# EAGLE design Philophrosyne (EAGLE 9.6.2)
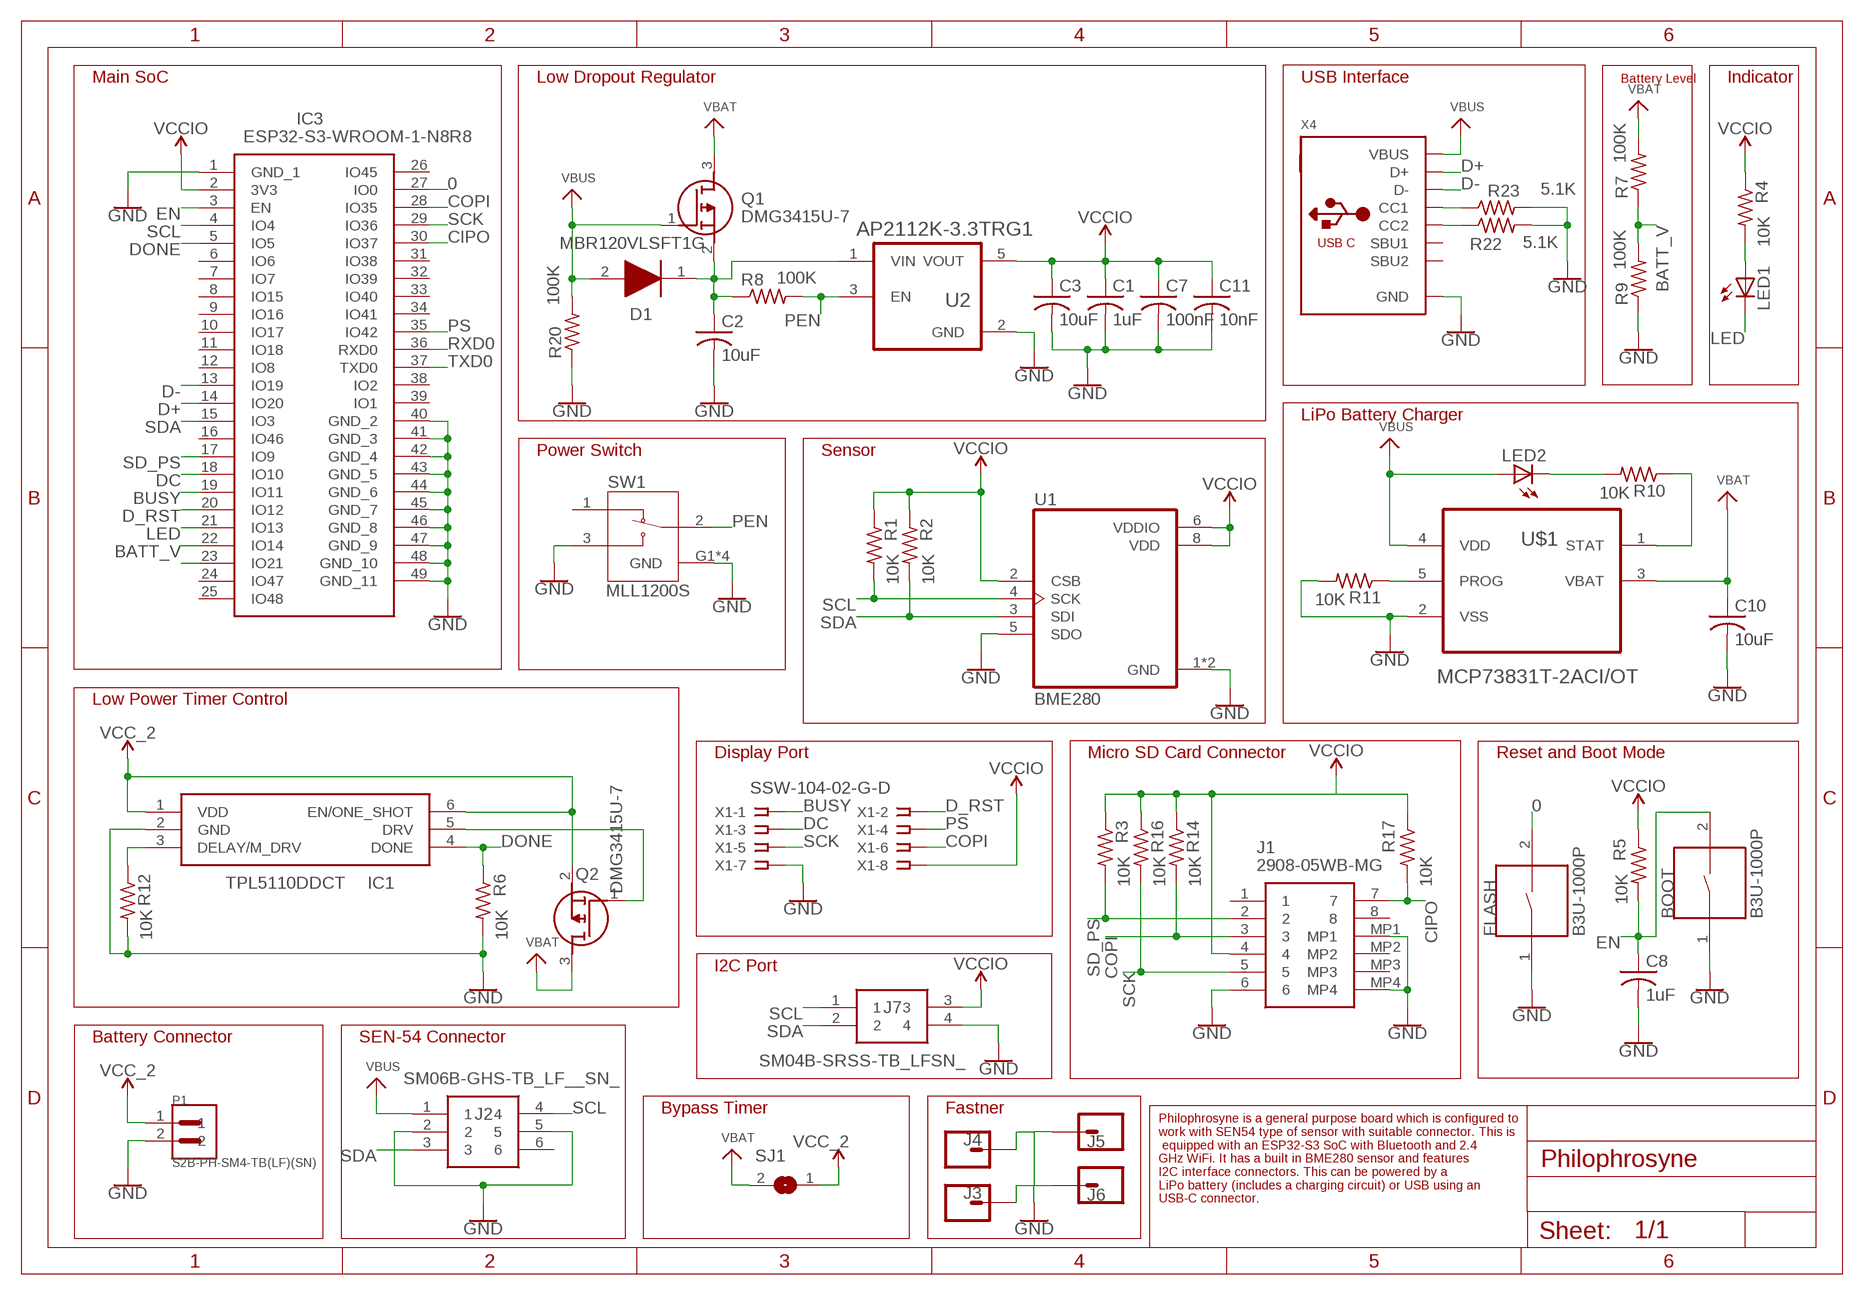
[diagram p0: schematic, sheet 1]

## Parts
BOOT  B3U-1000P  [SW_B3U-1000P]
C1  1uF  C-USC0402  [C0402]
C2  10uF  C-USC0402  [C0402]
C3  10uF  C-USC0402  [C0402]
C7  100nF  C-USC0402  [C0402]
C8  1uF  C-USC0402  [C0402]
C10  10uF  C-USC0402  [C0402]
C11  10nF  C-USC0402  [C0402]
D1  MBR120VLSFT1G  [SODFL3616X98N]
FLASH  B3U-1000P  [SW_B3U-1000P]
IC1  TPL5110DDCT  [SOT95P280X110-6N]
IC3  ESP32-S3-WROOM-1-N8R8  [ESP32S3WROOM1N8R8]
J1  2908-05WB-MG  [290805WBMG]
J2  SM06B-GHS-TB_LF__SN_  [SM06B-GHS-TB]
J3  CONN_01PTH_2MM  [1X01_2MM]
J4  CONN_01PTH_2MM  [1X01_2MM]
J5  CONN_01PTH_2MM  [1X01_2MM]
J6  CONN_01PTH_2MM  [1X01_2MM]
J7  SM04B-SRSS-TB_LFSN_  [SM04B-SRSS-TB(LFSN)]
LED1  LEDCHIP-LED0603  [CHIP-LED0603]
LED2  LEDCHIP-LED0603  [CHIP-LED0603]
P1  S2B-PH-SM4-TB(LF)(SN)  [JST_S2B-PH-SM4-TB(LF)(SN)]
Q1  DMG3415U-7  [SOT96P240X100-3N]
Q2  DMG3415U-7  [SOT96P240X100-3N]
R1  10K  R-US_R0402  [R0402]
R2  10K  R-US_R0402  [R0402]
R3  10K  R-US_R0402  [R0402]
R4  10K  R-US_R0402  [R0402]
R5  10K  R-US_R0402  [R0402]
R6  10K  R-US_R0402  [R0402]
R7  100K  R-US_R0402  [R0402]
R8  100K  R-US_R0402  [R0402]
R9  100K  R-US_R0402  [R0402]
R10  10K  R-US_R0402  [R0402]
R11  10K  R-US_R0402  [R0402]
R12  10K  R-US_R0402  [R0402]
R14  10K  R-US_R0402  [R0402]
R16  10K  R-US_R0402  [R0402]
R17  10K  R-US_R0402  [R0402]
R20  100K  R-US_R0402  [R0402]
R22  5.1K  R-US_R0402  [R0402]
R23  5.1K  R-US_R0402  [R0402]
SJ1  SJ  [SJ]
SW1  MLL1200S  [SW_MLL1200S]
U1  BME280  [PSON65P250X250X100-8N]
U2  AP2112K-3.3TRG1  [SOT95P285X140-5N]
U$1  MCP73831T-2ACI/OT  [SOT95P280X145-5N]
X1  SSW-104-02-G-D  [SSW-104-02-G-D]
X4  MICROBUILDER_USB_C  [MICROBUILDER_USB_C_CUSB31-CFM2AX-01-X]

## Nets
0: FLASH.2 IC3.27(IO0)
BATT_V: IC3.22(IO14) R7.1 R9.2
BUSY: IC3.19(IO11) X1.1
CIPO: IC3.30(IO37) J1.7 R17.2
COPI: IC3.28(IO35) J1.3 R14.2 X1.6
D+: IC3.14(IO20) X4.A6(D+) X4.B6(D+)
D-: IC3.13(IO19) X4.A7(D-) X4.B7(D-)
D_RST: IC3.20(IO12) X1.2
DC: IC3.18(IO10) X1.3
DONE: IC1.4(DONE) IC3.5(IO5) R6.1
EN: BOOT.2 C8.1 IC3.3(EN) R5.2
GND: BOOT.1 C1.2 C2.2 C3.2 C7.2 C8.2 C10.2 C11.2 FLASH.1 IC1.2(GND) IC3.1(GND_1) IC3.40(GND_2) IC3.41(GND_3) IC3.42(GND_4) IC3.43(GND_5) IC3.44(GND_6) IC3.45(GND_7) IC3.46(GND_8) IC3.47(GND_9) IC3.48(GND_10) IC3.49(GND_11) J1.6 J1.MP1 J1.MP4 J2.2 J2.5 J3.1 J4.1 J5.1 J6.1 J7.4 P1.2 R6.2 R9.1 R11.2 R12.2 R20.1 R22.2 R23.2 SW1.3 SW1.G1(GND) SW1.G2(GND) SW1.G3(GND) SW1.G4(GND) U1.1(GND) U1.5(SDO) U1.7(GND) U2.2(GND) U$1.2(VSS) X1.7 X4.A1B12(GND) X4.B1A12(GND)
LED: IC3.21(IO13) LED1.C
N$5: C2.1 D1.1(K) Q1.2(S) R8.1 U2.1(VIN)
N$6: IC3.23(IO21)
N$7: R22.1 X4.B5(CC2)
N$8: R11.1 U$1.5(PROG)
N$9: R23.1 X4.A5(CC1)
N$10: LED1.A R4.2
N$12: IC1.5(DRV) Q2.1(G)
N$14: R10.1 U$1.1(STAT)
N$16: LED2.C R10.2
N$17: IC1.3(DELAY/M_DRV) R12.1
PEN: R8.2 SW1.2 U2.3(EN)
PS: IC3.35(IO42) X1.4
RXD0: IC3.36(RXD0)
SCK: IC3.29(IO36) J1.5 R16.2 X1.5
SCL: IC3.4(IO4) J2.4 J7.1 R1.2 U1.4(SCK)
SD_PS: IC3.17(IO9) J1.2 R3.2
SDA: IC3.15(IO3) J2.3 J7.2 R2.2 U1.3(SDI)
TXD0: IC3.37(TXD0)
VBAT: C10.1 Q1.3(D) Q2.3(D) R7.2 SJ1.2 U$1.3(VBAT)
VBUS: D1.2(A) J2.1 LED2.A Q1.1(G) R20.2 U$1.4(VDD) X4.A4B9(VBUS) X4.B4A9(VBUS)
VCC_2: IC1.1(VDD) IC1.6(EN/ONE_SHOT) P1.1 Q2.2(S) SJ1.1
VCCIO: C1.1 C3.1 C7.1 C11.1 IC3.2(3V3) J1.4 J7.3 R1.1 R2.1 R3.1 R4.1 R5.1 R14.1 R16.1 R17.1 U1.2(CSB) U1.6(VDDIO) U1.8(VDD) U2.5(VOUT) X1.8
Unconnected: IC3.6(IO6) IC3.7(IO7) IC3.8(IO15) IC3.9(IO16) IC3.10(IO17) IC3.11(IO18) IC3.12(IO8) IC3.16(IO46) IC3.24(IO47) IC3.25(IO48) IC3.26(IO45) IC3.31(IO38) IC3.32(IO39) IC3.33(IO40) IC3.34(IO41) IC3.38(IO2) IC3.39(IO1) J1.1 J1.8 J1.MP2 J1.MP3 J2.6 SW1.1 X4.A8(SBU1) X4.B8(SBU2)

## Notes on the sheet
- Main SoC | Low Dropout Regulator | USB Interface | Battery Level | Indicator
- LiPo Battery Charger
- Power Switch | Sensor
- Low Power Timer Control
- Display Port | Micro SD Card Connector | Reset and Boot Mode
- I2C Port
- Battery Connector | SEN-54 Connector
- Bypass Timer | Fastner
- Philophrosyne is a general purpose board which is configured to 
  work with SEN54 type of sensor with suitable connector. This is
   equipped with an ESP32-S3 SoC with Bluetooth and 2.4 
  GHz WiFi. It has a built in BME280 sensor and features 
  I2C interface connectors. This can be powered by a 
  LiPo battery (includes a charging circuit) or USB using an 
  USB-C connector.

## Library data of the parts
BOOT FLASH = B3U-1000P:B3U-1000P: Switch Tactile N.O. SPST Round Button Gull Wing 0.05A 12VDC 1.5N SMD Embossed T/R; AVAILABILITY: Unavailable; DESCRIPTION: Switch Tactile N.O. SPST Round Button Gull Wing 0.05A 12VDC 1.5N SMD Embossed T/R; MF: Omron; MP: B3U-1000P; PACKAGE: None; PRICE: None
C1-C3 C7 C8 C10 C11 = adafruit:C-US: CAPACITOR, American symbol
D1 = MBR120VLSFT1G:MBR120VLSFT1G: Diode Schottky 20V 1A SOD123FL ON Semi MBR120VLSFT1G, SMT Schottky Diode, 20V 1A, 2-Pin SOD-123FL Source: Datasheet <http://www.onsemi.com/pub/Collateral/MBR120VLSFT1-D.PDF>; DESCRIPTION: Diode Schottky 20V 1A SOD123FL ON Semi MBR120VLSFT1G, SMT Schottky Diode, 20V 1A, 2-Pin SOD-123FL; HEIGHT: 0.98mm; MANUFACTURER_NAME: ON Semiconductor; MANUFACTURER_PART_NUMBER: MBR120VLSFT1G; MOUSER_PART_NUMBER: 863-MBR120VLSFT1G; MOUSER_PRICE-STOCK: https://www.mouser.co.uk/ProductDetail/ON-Semiconductor/MBR120VLSFT1G?qs=3JMERSakebpX%252BkItPpFCkg%3D%3D
IC1 = TPL5110DDCT:TPL5110DDCT: Ultra Low Power Timer with MOS driver and MOSFET Power ON Source: Datasheet <https://datasheet.datasheetarchive.com/originals/distributors/DKDS-23/444465.pdf>; ARROW_PART_NUMBER: TPL5110DDCT; ARROW_PRICE-STOCK: https://www.arrow.com/en/products/tpl5110ddct/texas-instruments?utm_currency=USD&region=nac; DESCRIPTION: Ultra Low Power Timer with MOS driver and MOSFET Power ON; HEIGHT: 1.1mm; MANUFACTURER_NAME: Texas Instruments; MANUFACTURER_PART_NUMBER: TPL5110DDCT; MOUSER_PART_NUMBER: 595-TPL5110DDCT; MOUSER_PRICE-STOCK: https://www.mouser.co.uk/ProductDetail/Texas-Instruments/TPL5110DDCT?qs=beZBGHSk9c2OL5zXl%2FkTOg%3D%3D
IC3 = ESP32-S3-WROOM-1-N8R8:ESP32-S3-WROOM-1-N8R8: WiFi Modules - 802.11 (Engineering Samples Only) SMD Module, ESP32-S3R8 with 8 MB Octal PSRAM Die, 8 MB Quad SPI flash, PCB Antenna Source: Datasheet <https://www.espressif.com/sites/default/files/documentation/esp32-s3-wroom-1_wroom-1u_datasheet_en.pdf>; DESCRIPTION: WiFi Modules - 802.11 (Engineering Samples Only) SMD Module, ESP32-S3R8 with 8 MB Octal PSRAM Die, 8 MB Quad SPI flash, PCB Antenna; HEIGHT: 3.25mm; MANUFACTURER_NAME: Espressif Systems; MANUFACTURER_PART_NUMBER: ESP32-S3-WROOM-1-N8R8; MOUSER_PART_NUMBER: 356-EP32S3WROOM1N8R8; MOUSER_PRICE-STOCK: https://www.mouser.co.uk/ProductDetail/Espressif-Systems/ESP32-S3-WROOM-1-N8R8?qs=7D1LtPJG0i3%2F28hKFavOpQ%3D%3D
J1 = 2908-05WB-MG:2908-05WB-MG: Memory Card Connectors MICROSD 8P P/P SMT POLARIZED Source: Datasheet <https://componentsearchengine.com/Datasheets/1/2908-05WB-MG.pdf>; ARROW_PART_NUMBER: 2908-05WB-MG; ARROW_PRICE-STOCK: https://www.arrow.com/en/products/2908-05wb-mg/3m?region=europe; DESCRIPTION: Memory Card Connectors MICROSD 8P P/P SMT POLARIZED; HEIGHT: 1.85mm; MANUFACTURER_NAME: 3M; MANUFACTURER_PART_NUMBER: 2908-05WB-MG; MOUSER_PART_NUMBER: 517-2908-05WB-MG; MOUSER_PRICE-STOCK: https://www.mouser.co.uk/ProductDetail/3M-Electronic-Solutions-Division/2908-05WB-MG?qs=vnwGVgFuQiZPJoOt79ALlw%3D%3D
J2 = SM06B-GHS-TB_LF__SN_:SM06B-GHS-TB_LF__SN_: GH 1.25mm header side entry 6 way JST GH Series, 1.25mm Pitch 6 Way Right Angle PCB Header, Solder Termination, 1A Source: Datasheet <https://datasheet.datasheetarchive.com/originals/distributors/Datasheets_SAMA/e4ef010dc292ea31091454f6c0afb63a.pdf>; ARROW_PART_NUMBER: SM06B-GHS-TB(LF)(SN); ARROW_PRICE-STOCK: https://www.arrow.com/en/products/sm06b-ghs-tb-lf-sn/jst-manufacturing; DESCRIPTION: GH 1.25mm header side entry 6 way JST GH Series, 1.25mm Pitch 6 Way Right Angle PCB Header, Solder Termination, 1A; HEIGHT: mm; MANUFACTURER_NAME: JST (JAPAN SOLDERLESS TERMINALS); MANUFACTURER_PART_NUMBER: SM06B-GHS-TB(LF)(SN); MOUSER_PART_NUMBER: N/A; MOUSER_PRICE-STOCK: https://www.mouser.co.uk/ProductDetail/JST-Commercial/SM06B-GHS-TBLFSN?qs=QpmGXVUTftFzTQe43vH9Ig%3D%3D
J3-J6 = SparkFun-Connectors:CONN_01: Single connection point. Often used as Generic Header-pin footprint for 0.1 inch spaced/style header connections On any of the 0.1 inch spaced packages, you can populate with these: Break Away Headers - Straight <https://www.sparkfun.com/products/116> (PRT-00116) Break Away Male Headers - Right Angle <https://www.sparkfun.com/products/553> (PRT-00553) Female Headers <https://www.sparkfun.com/products/115> (PRT-00115) Break Away Headers - Machine Pin <https://www.sparkfun.com/products/117> (PRT-00117) Break Away Female Headers - Swiss Machine Pin <https://www.sparkfun.com/products/743> (PRT-00743) This device is also useful as a general connection point to wire up your design to another part of your project. Our various solder wires solder well into these plated through hole pads. Hook-Up Wire - Assortment (Stranded, 22 AWG) <https://www.sparkfun.com/products/11375> (PRT-11375) Hook-Up Wire - Assortment (Solid Core, 22 AWG) <https://www.sparkfun.com/products/11367> (PRT-11367) View the entire wire category on our website here <https://www.sparkfun.com/categories/141> Special notes: SMTSO-256-ET is a "flush mount" nut for a 4-40 screw. We mostly use this on specialty testbeds; it is a nice way to connect hardware to your PCB at an adjustable hieght. Also note, the SNAP packages are for using a snappable style connector. We sell a baggie of snaps and they are also used on two LilyPad designs: Snap Assortment - 30 pack (male and female) <https://www.sparkfun.com/products/11347> (DEV-11347) LilyPad Arduino SimpleSnap <https://www.sparkfun.com/products/10941> (DEV-10941) LilyPad SimpleSnap Protoboard <https://www.sparkfun.com/products/10940> (DEV-10940)
J7 = SM04B-SRSS-TB_LFSN_:SM04B-SRSS-TB_LFSN_: 4 way side entry SMT header,1mm pitch JST SH Series, 1mm Pitch 4 Way 1 Row Right Angle PCB Header, Solder Termination, 1A Source: Datasheet; DESCRIPTION: 4 way side entry SMT header,1mm pitch JST SH Series, 1mm Pitch 4 Way 1 Row Right Angle PCB Header, Solder Termination, 1A; HEIGHT: mm; MANUFACTURER_NAME: JST (JAPAN SOLDERLESS TERMINALS); MANUFACTURER_PART_NUMBER: SM04B-SRSS-TB(LFSN)
LED1 LED2 = adafruit_Tanmoy:LED: LED OSRAM: - CHIPLED LG R971, LG N971, LY N971, LG Q971, LY Q971, LO R971, LY R971 LH N974, LH R974 LS Q976, LO Q976, LY Q976 LO Q996 - Hyper CHIPLED LW Q18S LB Q993, LB Q99A, LB R99A - SideLED LS A670, LO A670, LY A670, LG A670, LP A670 LB A673, LV A673, LT A673, LW A673 LH A674 LY A675 LS A676, LA A676, LO A676, LY A676, LW A676 LS A679, LY A679, LG A679 - Hyper Micro SIDELED® LS Y876, LA Y876, LO Y876, LY Y876 LT Y87S - SmartLED LW L88C, LW L88S LB L89C, LB L89S, LG L890 LS L89K, LO L89K, LY L89K LS L896, LA L896, LO L896, LY L896 - TOPLED LS T670, LO T670, LY T670, LG T670, LP T670 LSG T670, LSP T670, LSY T670, LOP T670, LYG T670 LG T671, LOG T671, LSG T671 LB T673, LV T673, LT T673, LW T673 LH T674 LS T676, LA T676, LO T676, LY T676, LB T676, LH T676, LSB T676, LW T676 LB T67C, LV T67C, LT T67C, LS T67K, LO T67K, LY T67K, LW E67C LS E67B, LA E67B, LO E67B, LY E67B, LB E67C, LV E67C, LT E67C LW T67C LS T679, LY T679, LG T679 LS T770, LO T770, LY T770, LG T770, LP T770 LB T773, LV T773, LT T773, LW T773 LH T774 LS E675, LA E675, LY E675, LS T675 LS T776, LA T776, LO T776, LY T776, LB T776 LHGB T686 LT T68C, LB T68C - Hyper Mini TOPLED® LB M676 - Mini TOPLED Santana® LG M470 LS M47K, LO M47K, LY M47K Source: http://www.osram.convergy.de/
P1 = S2B-PH-SM4-TB_LF__SN_:S2B-PH-SM4-TB(LF)(SN): CONN HEADER PH SIDE 2POS 2MM SMD; AVAILABILITY: Unavailable; DESCRIPTION: Connector Header Surface Mount, Right Angle 2 position 0.079 _2.00mm_; MF: JST Sales; MP: S2B-PH-SM4-TB _LF__SN_; PACKAGE: None; PRICE: None
Q1 Q2 = DMG3415U-7:DMG3415U-7: P-CHANNEL ENHANCEMENT MODE MOSFET Source: Datasheet <https://datasheet.lcsc.com/szlcsc/Diodes-Incorporated-DMG3415U-7_C96616.pdf>; DESCRIPTION: P-CHANNEL ENHANCEMENT MODE MOSFET; HEIGHT: 1mm; LCSC_PART_NUMBER: C96616; LCSC_PRICE-STOCK: https://lcsc.com/product-detail/MOSFET_Diodes-Incorporated_DMG3415U-7_Diodes-Incorporated-DMG3415U-7_C96616.html; MANUFACTURER_NAME: Diodes Inc.; MANUFACTURER_PART_NUMBER: DMG3415U-7
R1-R12 R14 R16 R17 R20 R22 R23 = adafruit:R-US_: RESISTOR, American symbol
SJ1 = jumper:SJ: SMD solder JUMPER
SW1 = MLL1200S:MLL1200S: Switch Slide SPDT Side Slide 0.3A 4VDC Gull Wing SMD Box Check prices <https://pricing.snapeda.com/parts/MLL1200S/TE%20Connectivity/view-part?ref=eda>; AVAILABILITY: In Stock; COMMENT: 1437575-1; DESCRIPTION: Slide Switch SPDT Surface Mount, Right Angle; MF: TE Connectivity; MP: MLL1200S; PACKAGE: None; PRICE: None; PURCHASE-URL: https://pricing.snapeda.com/search/part/MLL1200S/?ref=eda
U1 = BME280:BME280: Check availability <https://pricing.snapeda.com/parts/BME280/Bosch/view-part?ref=eda>; AVAILABILITY: In Stock; CHECK_PRICES: https://www.snapeda.com/parts/BME280/Bosch/view-part/?ref=eda; DESCRIPTION: Board Mount Humidity Sensors MEMS humidity, pressure and temperature sensor; MF: Bosch; MP: BME280; PACKAGE: LGA-8 Bosch; PRICE: None; SNAPEDA_LINK: https://www.snapeda.com/parts/BME280/Bosch/view-part/?ref=snap
U2 = AP2112K-3.3TRG1:AP2112K-3.3TRG1: AP2112 Series 0.6 A 3.3 V Fixed Output SMT LDO Linear Regulator - SOT23-5; AVAILABILITY: Unavailable; DESCRIPTION: AP2112 Series 0.6 A 3.3 V Fixed Output SMT LDO Linear Regulator - SOT23-5; MF: Diodes Inc.; MP: AP2112K-3.3TRG1; PACKAGE: SOT-753 Diodes Inc.; PRICE: None
U$1 = MCP73831T-2ACI_OT:MCP73831T-2ACI/OT: Charge Management Controller; AVAILABILITY: Unavailable; DESCRIPTION: MCP73831 Series Single-Cell Li-Ion/Li-Polymer Battery Charge Controller SOT-23-5; MF: Microchip; MP: MCP73831T-2ACI/OT; PACKAGE: SOT-23 Microchip; PRICE: None
X1 = con-samtec:SSW-104-02-G: THROUGH-HOLE .025" SQ POST SOCKET Source: Samtec SSW.pdf; MF: Samtec Inc.; MPN: SSW-104-02-G-D; OC_FARNELL: 1668346; OC_NEWARK: 11P9382
X4 = Adafruit Feather STM32F405 Express:MICROBUILDER_USB_C: USB Type-C USB 2.0 Connector

## Board
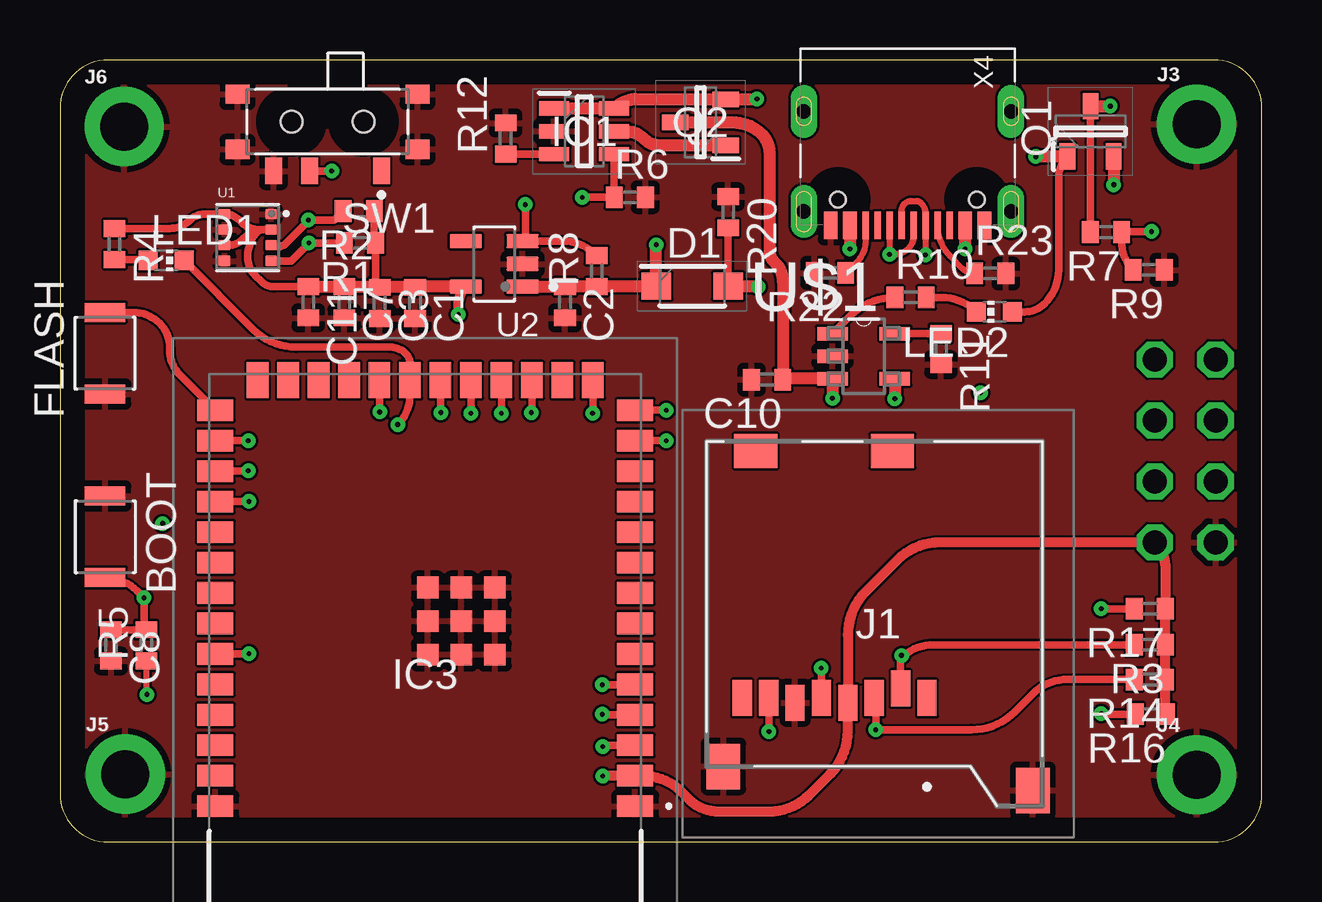
[diagram p1: board, top side]
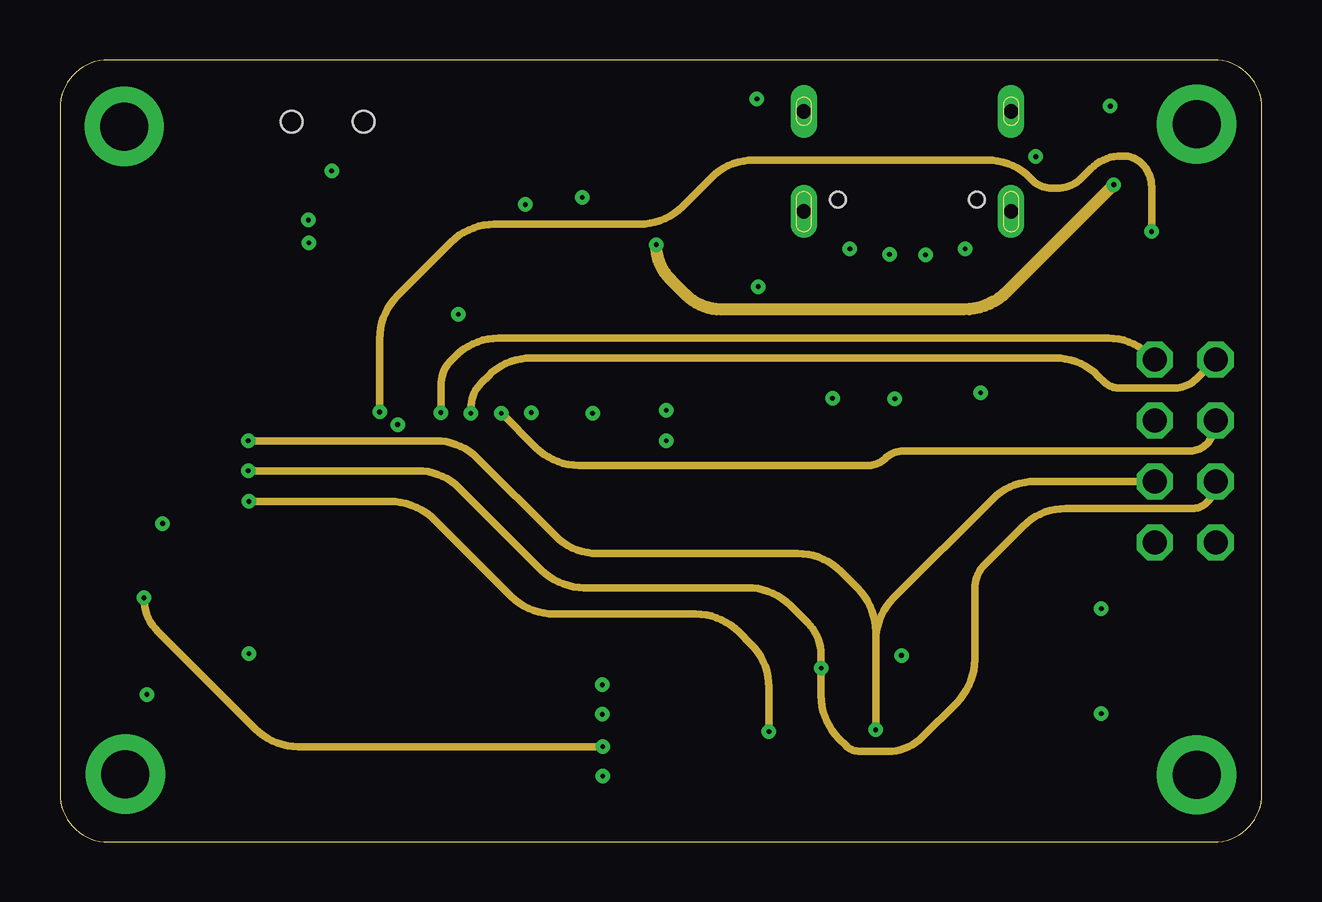
[diagram p2: board, inner layer Route2]
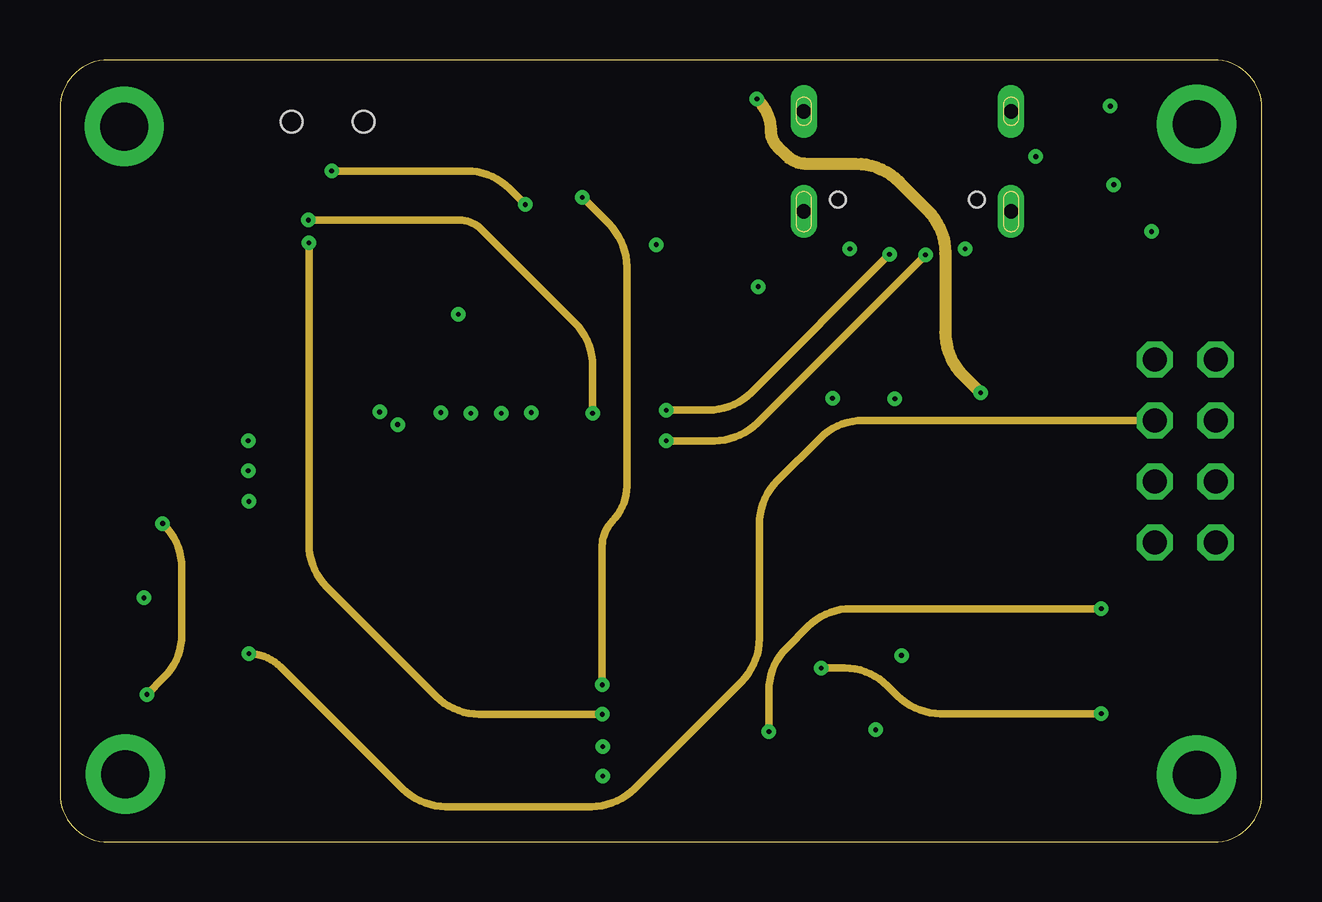
[diagram p3: board, inner layer Route15]
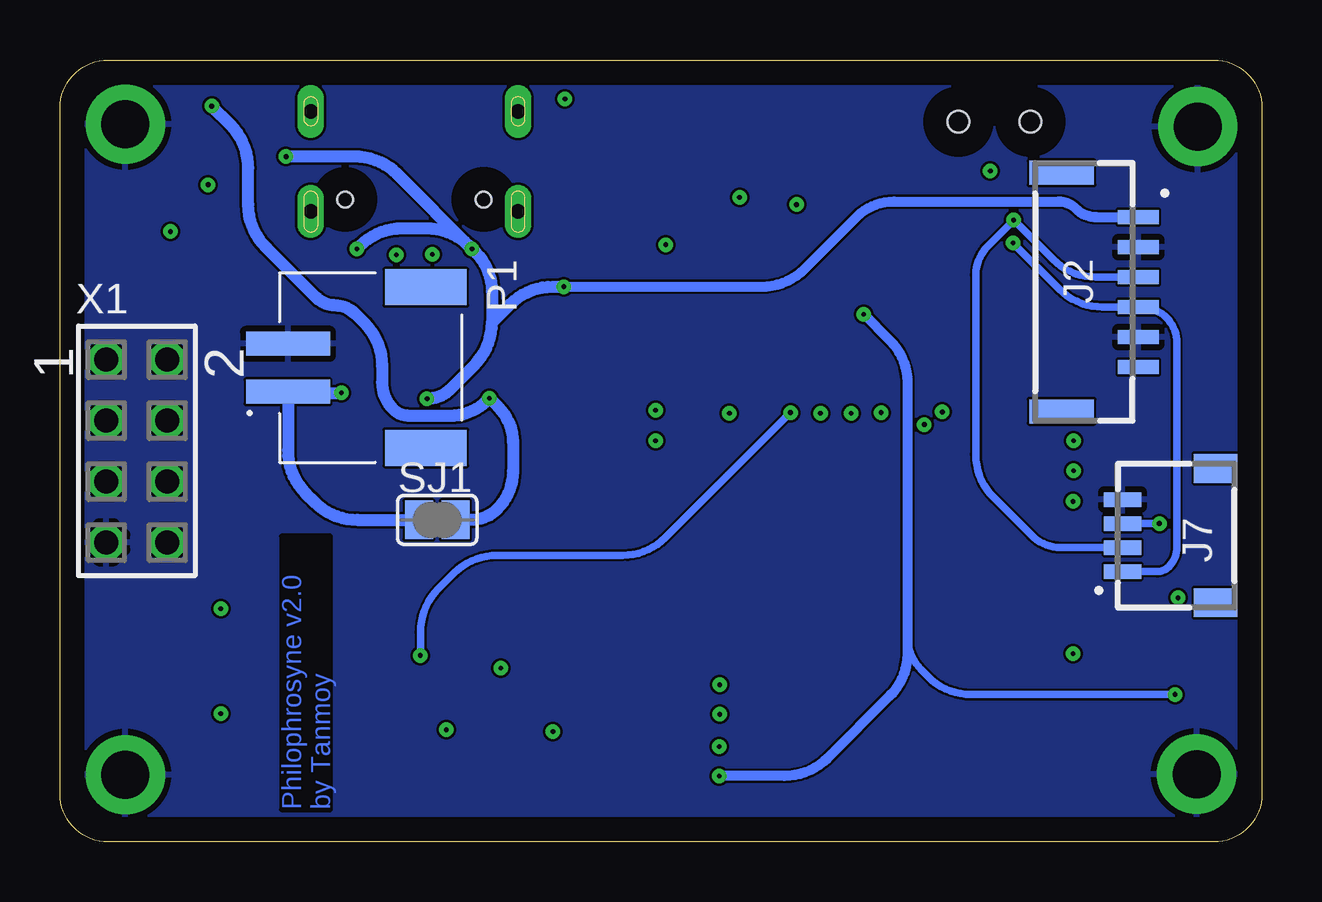
[diagram p4: board, bottom side, seen from below]

Size 50.1 x 32.6 mm. Coordinates in mm from the lower left corner, seen from the top.
Outline: 2,0 48.1,0 arc90 50.1,2 50.1,30.6 arc90 48.1,32.6 2,32.6 arc90 0,30.6 0,2 arc90 2,0
Copper layers (1+2+15+16): Top 0.035mm / dielectric 1.5mm / Route2 0.035mm / dielectric 0.15mm / Route15 0.035mm / dielectric 0.2mm / Bottom 0.035mm
Design rules "default *": minimum track width 4mil, minimum drill 0.2mm, track to track 4mil, track to pad 4mil, pad to pad 4mil, via to via 4mil, smd to smd 4mil, copper to edge 40mil, drill to drill 4mil, minimum pad ring 10mil, minimum via ring 8mil, stop-mask expansion 4mil, vias tented up to drill 0mil, thermal gap 10mil

### Footprints (pad centres in the part's own frame; a part is rotated, then mirrored left to right if it is on the bottom)
SW_B3U-1000P = smd 0.8 x 1.7: 1 -1.7,0; 2 1.7,0
C0402 = smd 0.7 x 0.9: 1 -0.65,0; 2 0.65,0
SODFL3616X98N = smd 1.24 x 1.12: 1 -1.5,0; 2 1.5,0
SOT95P280X110-6N = smd 1.25 x 0.6: 1 -1.25,0.95; 2 -1.25,0; 3 -1.25,-0.95; 4 1.25,-0.95; 5 1.25,0; 6 1.25,0.95
ESP32S3WROOM1N8R8 = smd 1.5 x 0.9: 1 -8.75,5.26; 2 -8.75,3.99; 3 -8.75,2.72; 4 -8.75,1.45; 5 -8.75,0.18; 6 -8.75,-1.09; 7 -8.75,-2.36; 8 -8.75,-3.63; 9 -8.75,-4.9; 10 -8.75,-6.17; 11 -8.75,-7.44; 12 -8.75,-8.71; 13 -8.75,-9.98; 14 -8.75,-11.25; 27 8.75,-11.25; 28 8.75,-9.98; 29 8.75,-8.71; 30 8.75,-7.44; 31 8.75,-6.17; 32 8.75,-4.9; 33 8.75,-3.63; 34 8.75,-2.36; 35 8.75,-1.09; 36 8.75,0.18; 37 8.75,1.45; 38 8.75,2.72; 39 8.75,3.99; 40 8.75,5.26 | smd 0.9 x 1.5: 15 -6.985,-12.5; 16 -5.715,-12.5; 17 -4.445,-12.5; 18 -3.175,-12.5; 19 -1.905,-12.5; 20 -0.635,-12.5; 21 0.635,-12.5; 22 1.905,-12.5; 23 3.175,-12.5; 24 4.445,-12.5; 25 5.715,-12.5; 26 6.985,-12.5 | smd 0.9 x 0.9: 41 -1.5,-2.46; 42 -1.5,-1.06; 43 -2.9,-1.06; 44 -2.9,-2.46; 45 -2.9,-3.86; 46 -1.5,-3.86; 47 -0.1,-3.86; 48 -0.1,-2.46; 49 -0.1,-1.06
290805WBMG = smd 0.8 x 1.5: 1 -2.04,3.1; 2 -0.94,2.7; 3 0.16,3.1; 4 1.26,3.3; 5 2.36,3.1; 6 3.46,3.3; 7 4.56,3.1; 8 5.66,3.1 | smd 1.4 x 1.9: MP1 6.45,5.95; MP4 -6.45,6.95 | smd 1.8 x 1.4: MP2 5.1,-7.2; MP3 -0.6,-7.2
SM06B-GHS-TB = smd 0.6 x 1.7: 1 2.25,4.3; 2 3.5,4.3; 3 4.75,4.3; 4 6,4.3; 5 7.25,4.3; 6 8.5,4.3 | smd 1 x 2.7: 7 0.4,1.1; 8 10.35,1.1
1X01_2MM = drill 2 pad 3.302: 1 0,0
SM04B-SRSS-TB(LFSN) = smd 0.6 x 1.55: 1 1.5,4.661; 2 2.5,4.661; 3 3.5,4.661; 4 4.5,4.661 | smd 1.2 x 1.8: 5 0.2,0.786; 6 5.8,0.786
CHIP-LED0603 = smd 0.8 x 0.8: A 0,-0.75; C 0,0.75
JST_S2B-PH-SM4-TB(LF)(SN) = smd 1 x 3.5: 1 1,0; 2 -1,0 | smd 1.5 x 3.4: P1 3.35,5.75; P2 -3.35,5.75
SOT96P240X100-3N = smd 1.1 x 0.65: 1 -1.05,0.96; 2 -1.05,-0.96; 3 1.05,0
R0402 = smd 0.7 x 0.9: 1 -0.65,0; 2 0.65,0
SJ = smd 1.168 x 1.6: 1 -0.762,0; 2 0.762,0
SW_MLL1200S = smd 0.7 x 1.1: 1 -2.25,2.05; 2 0.75,2.05; 3 2.25,2.05 | smd 1 x 0.8: G1 -3.75,1.15; G2 3.75,1.15; G3 -3.75,-1.15; G4 3.75,-1.15 | hole 0.9: -1.5,0; 1.5,0
PSON65P250X250X100-8N = smd 0.49 x 0.45: 1 0.97,0.975; 2 0.97,0.325; 3 0.97,-0.325; 4 0.97,-0.975; 5 -0.97,-0.975; 6 -0.97,-0.325; 7 -0.97,0.325; 8 -0.97,0.975
SOT95P285X140-5N = smd 1.35 x 0.6: 1 -1.185,0.95; 2 -1.185,0; 3 -1.185,-0.95; 4 1.185,-0.95; 5 1.185,0.95
SOT95P280X145-5N = smd 1.27 x 0.559: 1 -1.295,0.94; 2 -1.295,0; 3 -1.295,-0.94; 4 1.295,-0.94; 5 1.295,0.94
SSW-104-02-G-D = drill 1 pad 1.5 octagon: 1 -3.81,-1.27; 2 -3.81,1.27; 3 -1.27,-1.27; 4 -1.27,1.27; 5 1.27,-1.27; 6 1.27,1.27; 7 3.81,-1.27; 8 3.81,1.27
MICROBUILDER_USB_C_CUSB31-CFM2AX-01-X = smd 0.575 x 1.15: A1B12 -3.2,3.545; A4B9 -2.4,3.545; B1A12 3.2,3.545; B4A9 2.4,3.545 | smd 0.275 x 1.15: A5 -1.25,3.545; A6 -0.25,3.545; A7 0.25,3.545; A8 1.25,3.545; B5 1.75,3.545; B6 0.75,3.545; B7 -0.75,3.545; B8 -1.75,3.545 | drill 0.6 pad 1 long: M1 -4.32,2.97; M2 4.32,2.97; M3 -4.32,-1.21; M4 4.32,-1.21 | hole 0.65: 2.89,2.47; -2.89,2.47

### Placement (x,y rotation side)
BOOT  1.88,12.72 270 top
C1  14.8,22.48 270 top
C2  21.05,22.5 270 top
C3  13.32,22.48 270 top
C7  11.85,22.5 270 top
C8  2.12,8.2 270 top
C10  29.48,19.27 180 top
C11  10.35,22.5 270 top
D1  26.35,23.18 0 top
FLASH  1.88,20.38 90 top
IC1  21.85,29.62 0 top
IC3  15.22,6.75 180 top
J1  34.1,9.1 180 top
J2  9.45,28.3 270 bottom
J3  47.38,29.93 0 top
J4  47.38,2.8 0 top
J5  2.73,2.83 0 top
J6  2.67,29.82 0 top
J7  1.15,9.78 90 bottom
LED1  4.42,24.25 270 top
LED2  38.95,22.1 90 top
P1  40.6,19.77 270 bottom
Q1  42.95,29.62 90 top
Q2  26.7,30 180 top
R1  12.5,24.98 180 top
R2  12.45,26.3 180 top
R3  45.42,8.22 180 top
R4  2.27,24.93 270 top
R5  3.6,8.2 90 top
R6  23.75,26.88 0 top
R7  43.6,25.43 180 top
R8  22.38,23.8 90 top
R9  45.38,23.85 180 top
R10  35.45,22.7 0 top
R11  36.73,20.55 270 top
R12  18.57,29.32 90 top
R14  45.42,6.78 180 top
R16  45.48,5.33 180 top
R17  45.42,9.72 180 top
R20  27.85,26.25 270 top
R22  32.1,23.73 180 top
R23  38.77,23.7 0 top
SJ1  34.38,13.43 0 bottom
SW1  11.15,30.02 180 top
U1  7.83,25.2 0 top
U2  18.1,24.1 180 top
U$1  33.5,20.25 0 top
X1  46.9,16.3 270 bottom
X4  35.33,29.25 180 top

### Tracks (layer width: path | path; a pad name or v marks a point on that pad's centre or on a via)
0
  Top 0.305: IC3.27 5,19.48 arc-45 4.58,20.5 4.58,20.6 arc45 4.15,21.62 arc45 3.06,22.07 FLASH.2
BATT_V  (via drill 0.2)
  Top 0.305: R9.2 arc-45 44.25,25 R7.1 arc-45 44.31,25.45 v45.5,25.45 | IC3.22 v13.32,17.94 arc-45 v13.32,17.93
  Route2 0.305: v13.32,17.93 13.32,20.97 arc-45 14.07,22.77 16.31,25.01 arc-45 18.1,25.75 24.15,25.75 arc45 25.94,26.49 27.13,27.68 arc-45 28.93,28.43 38.65,28.43 arc-45 40.44,27.68 40.55,27.57 arc45 41.34,27.25 41.55,27.25 arc45 42.57,27.67 42.97,28.07 arc-45 44.25,28.6 44.31,28.6 arc-45 45.1,28.27 arc-45 45.5,27.31 v45.5,25.45
BUSY  (via drill 0.2)
  Top 0.305: IC3.19 v17.13,17.89 arc-45 v17.12,17.88
  Route2 0.305: v17.12,17.88 17.12,18.06 arc-45 17.57,19.15 17.86,19.43 arc-45 19.65,20.18 41.47,20.18 arc-45 43.27,19.43 43.52,19.18 arc45 44.13,18.93 46.45,18.93 arc45 47.36,19.3 X1.1
CIPO  (via drill 0.2)
  Top 0.305: IC3.30 7.85,14.19 arc-45 v7.88,14.2 | J1.7 arc-45 29.55,5.98 v29.55,4.6 | R17.2 v43.4,9.72
  Route2 0.305: v29.55,4.6 29.55,6.45 arc45 28.81,8.24 28.29,8.76 arc45 26.5,9.5 20.6,9.5 arc-45 18.81,10.24 15.64,13.41 arc45 13.73,14.2 v7.88,14.2
  Route15 0.305: v43.4,9.72 32.98,9.72 arc45 31.18,8.98 30.29,8.09 arc45 29.55,6.3 v29.55,4.6
COPI  (via drill 0.2)
  Top 0.305: IC3.28 7.84,16.73 arc45 v7.85,16.73 | J1.3 arc-45 34,5.86 v34,4.67 38,4.67 arc45 39.79,5.42 40.55,6.17 arc-45 42,6.78 R14.2
  Route2 0.305: v7.85,16.73 15.66,16.73 arc-45 17.39,16.01 20.63,12.77 arc45 22.43,12.03 30.75,12.03 arc-45 32.54,11.28 33.26,10.57 arc-45 34,8.77 v34,4.67 34,8.37 arc-45 34.74,10.17 38.86,14.29 arc-45 40.66,15.03 X1.6
D+  (via drill 0.2)
  Top 0.254: X4.B6 v34.58,24.5 34.81,24.5 arc45 35.35,24.73 arc45 35.58,25.27 X4.A6
  Top 0.305: IC3.14 v25.27,18
  Route15 0.305: v34.58,24.5 28.82,18.74 arc-45 27.02,18 v25.27,18
D-  (via drill 0.2)
  Top 0.254: v36.08,24.48 X4.B7 36.08,26.17 arc45 35.88,26.65 arc45 35.69,26.73 35.5,26.73 arc45 35.2,26.6 35.2,26.6 arc45 35.08,26.3 X4.A7
  Top 0.305: IC3.13 v25.26,16.73 arc-45 v25.27,16.73
  Route15 0.305: v36.08,24.48 29.07,17.47 arc-45 27.27,16.73 v25.27,16.73
D_RST  (via drill 0.2)
  Top 0.305: IC3.20 15.86,17.94 arc45 v15.88,17.9
  Route2 0.305: X1.2 45.48,20.26 arc45 43.69,21 18.28,21 arc45 16.48,20.26 16.32,20.1 arc45 15.88,19.01 v15.88,17.9
DC  (via drill 0.2)
  Top 0.305: IC3.18 v18.4,17.88
  Route2 0.305: X1.3 48.17,17.53 arc-45 47.77,16.57 arc-45 47.11,16.3 35.16,16.3 arc45 34.38,15.97 arc-45 33.71,15.7 21.63,15.7 arc-45 19.83,16.44 v18.4,17.88
DONE  (via drill 0.2)
  Top 0.305: IC1.4 R6.1 v21.77,26.88 | IC3.5 arc-45 23.93,6.55 v22.6,6.55
  Route15 0.305: v21.77,26.88 22.88,25.77 arc-45 23.62,23.97 23.62,14.82 arc-45 23.02,13.38 arc45 22.6,12.35 v22.6,6.55
EN  (via drill 0.2)
  Top 0.305: IC3.3 22.76,4.03 arc45 v22.62,3.98 | BOOT.2 arc-45 3.2,10.48 v3.5,10.18 3.5,9.09 arc45 R5.2 C8.1
  Route2 0.305: v22.62,3.98 9.93,3.98 arc-45 8.13,4.72 4.08,8.77 arc-45 v3.5,10.18
GND
  pour Top: 2.2,0.2 47.9,0.2 arc90 49.9,2.2 49.9,30.4 arc90 47.9,32.4 2.2,32.4 arc90 0.2,30.4 0.2,2.2 arc90
  pour Bottom: 0.2,2.2 0.2,30.4 arc-90 2.2,32.4 47.9,32.4 arc-90 49.9,30.4 49.9,2.2 arc-90 47.9,0.2 2.2,0.2 arc-90
LED  (via drill 0.2)
  Top 0.305: v14.07,17.4 arc45 14.59,18.64 IC3.21 14.59,19.95 arc45 14.43,20.35 arc45 13.76,20.62 9.85,20.62 arc-45 8.06,21.37 LED1.C
N$5  (via drill 0.2)
  Top 0.508: Q1.2 arc-45 43.92,28.54 v43.92,27.4 | U2.1 C2.1 R8.1 24.79,23.15 arc45 D1.1 v24.85,24.9
  Route2 0.508: v43.92,27.4 39.47,22.94 arc-45 37.67,22.2 27.55,22.2 arc-45 26.1,22.8 25.45,23.45 arc-45 v24.85,24.9
N$7
  Top 0.254: X4.B5 33.58,25.05 arc-45 33.2,24.15 32.79,23.74 arc-45 R22.1
N$8
  Top 0.305: U$1.5 36.7,21.19 arc45 R11.1
N$9
  Top 0.254: X4.A5 arc45 37.11,24.42 37.61,23.91 arc45 R23.1
N$10
  Top 0.305: R4.2 3.62,24.27 arc-45 LED1.A
N$12
  Top 0.508: IC1.5 23.6,29.62 arc-45 24.32,29.32 arc45 25.01,29.04 Q2.1
N$14
  Top 0.305: U$1.1 32.97,21.96 arc-45 34.77,22.7 R10.1
N$16
  Top 0.305: R10.2 36.75,22.7 arc-45 LED2.C
N$17
  Top 0.305: IC1.3 R12.1
PEN  (via drill 0.2)
  Top 0.305: R8.2 arc45 20.93,25.05 U2.3 arc45 19.4,25.33 v19.4,26.57 | SW1.2 v11.32,27.98
  Route15 0.305: v11.32,27.98 16.95,27.98 arc-45 18.74,27.23 v19.4,26.57
PS  (via drill 0.2)
  Top 0.305: IC3.35 arc-45 6.5,7.85 v7.88,7.85
  Route15 0.305: X1.4 33.47,17.57 arc45 31.68,16.83 29.89,15.04 arc45 29.15,13.25 29.15,8.48 arc-45 28.41,6.68 23.94,2.22 arc-45 22.15,1.48 16.08,1.48 arc-45 14.28,2.22 9.2,7.3 arc45 v7.88,7.85
SCK  (via drill 0.2)
  Top 0.305: IC3.29 7.81,15.46 arc45 v7.85,15.47 | J1.5 31.74,7.21 arc45 v31.73,7.25 | R16.2 43.46,5.33 arc-45 v43.4,5.35
  Route2 0.305: X1.5 arc-45 47.81,14.16 47.8,14.15 arc-45 47.2,13.9 41.93,13.9 arc45 40.13,13.16 38.55,11.57 arc45 38.12,10.55 38.12,7.6 arc-45 37.38,5.81 35.95,4.38 arc-45 34.5,3.77 33.35,3.77 arc-45 32.75,4.03 32.47,4.31 arc-45 31.73,6.1 v31.73,7.25 31.73,7.8 arc45 31.18,9.12 30.44,9.86 arc45 28.65,10.6 21.85,10.6 arc-45 20.06,11.34 16.64,14.76 arc45 14.91,15.47 v7.85,15.47
  Route15 0.305: v43.4,5.35 36.7,5.35 arc-45 34.91,6.09 34.49,6.51 arc45 32.7,7.25 v31.73,7.25
SCL  (via drill 0.2)
  Top 0.305: IC3.4 22.66,5.3 arc-45 v22.6,5.33 | R1.2 v10.38,24.98 9.62,24.23 U1.4
  Route15 0.305: v22.6,5.33 17.48,5.33 arc-45 15.68,6.07 11.12,10.63 arc-45 10.38,12.43 v10.38,24.98
  Bottom 0.305: v10.38,24.98 8.44,23.04 arc-45 6.65,22.3 J2.4 5.06,22.3 arc45 3.98,21.85 arc45 3.55,20.82 3.55,12.26 arc45 3.88,11.47 arc45 4.36,11.28 J7.1
SD_PS  (via drill 0.2)
  Top 0.305: IC3.17 19.67,17.95 arc-45 v19.65,17.9 | J1.2 35.04,7.65 | 35.04,7.65 35.04,7.69 arc-45 v35.08,7.78 | R3.2 36.43,8.22 arc45 35.04,7.65
  Bottom 0.305: v19.65,17.9 24.86,12.69 arc45 26.65,11.95 31.87,11.95 arc-45 33.67,11.21 34.33,10.54 arc-45 35.08,8.75 v35.08,7.78
SDA  (via drill 0.2)
  Top 0.305: IC3.15 22.21,17.9 arc-45 v22.2,17.88 | R2.2 11.43,25.93 v10.35,25.93 10.35,25.88 9.35,24.88 arc-45 U1.3
  Route15 0.305: v22.2,17.88 22.2,19.85 arc45 21.46,21.64 17.54,25.56 arc45 16.65,25.93 v10.35,25.93
  Bottom 0.305: J7.2 8.39,12.28 arc45 9.6,12.78 11.18,14.36 arc45 11.93,16.15 11.93,23.65 arc45 11.43,24.85 v10.35,25.93 8.72,24.29 arc-45 6.92,23.55 J2.3
VBAT  (via drill 0.2)
  Top 0.305: Q1.3 R7.2 | 30.19,19.31 arc-45 C10.1
  Top 0.508: Q1.3 v43.77,30.68 | v32.2,18.5 arc45 v32.2,18.51 U$1.3 30.19,19.31 | Q2.3 28.04,30 arc-45 29.25,29.5 arc-45 29.57,28.71 29.57,24.66 arc45 29.77,24.18 29.81,24.14 arc-45 30.12,23.38 C10.1
  Bottom 0.508: v43.77,30.68 42.99,29.89 arc45 42.25,28.1 42.25,26.58 arc-45 41.51,24.78 39.42,22.69 arc-45 38.65,22.38 arc45 37.8,22.02 37.42,21.64 arc45 36.67,19.85 36.67,19.16 arc-45 36.21,18.04 arc-45 35.57,17.77 33.83,17.77 arc-45 32.29,18.41 v32.2,18.5 31.83,18.13 arc45 31.23,16.68 31.23,15.44 arc45 31.88,13.88 arc45 32.96,13.43 SJ1.2
VBUS  (via drill 0.2)
  Top 0.305: LED2.A 40.2,22.1 arc45 41.05,22.45 arc45 41.62,23.84 41.62,27.69 arc-45 Q1.1 | R20.2 D1.2
  Top 0.508: X4.B4A9 v32.92,24.73 | X4.A4B9 v37.73,24.73 | Q1.1 v40.67,28.57 | U$1.4 v34.8,18.49 arc45 v34.8,18.48 | D1.2 29.04,23.18 arc-45 v29.1,23.15
  Bottom 0.406: v29.1,23.15 20.85,23.15 arc-45 19.06,23.89 16.89,26.06 arc45 15.34,26.7 8.47,26.7 arc45 7.75,26.4 arc-45 6.91,26.05 J2.1
  Bottom 0.508: v32.92,24.73 33.03,24.83 arc-45 34.83,25.57 35.85,25.57 arc-45 37.6,24.85 v37.73,24.73 | v32.92,24.73 36.03,27.83 arc-45 37.83,28.57 v40.67,28.57 | v32.92,24.73 32.77,24.57 arc45 32.1,22.95 32.1,21.65 | 32.1,21.65 arc45 32.84,19.86 33.82,18.88 arc45 v34.8,18.48 | 32.1,21.65 31.35,22.41 arc45 29.55,23.15 v29.1,23.15
VCC_2  (via drill 0.2)
  Top 0.508: IC1.1 IC1.6 arc-45 24.03,30.96 Q2.2 arc-45 27.79,30.98 v29.05,30.98
  Route15 0.508: v29.05,30.98 29.09,30.93 arc-45 29.62,29.65 arc45 29.89,29.01 30.27,28.62 arc45 31.12,28.27 33.17,28.27 arc-45 34.97,27.53 36.16,26.34 arc-45 36.9,24.55 36.9,21.25 arc45 37.64,19.46 v38.38,18.73
  Bottom 0.508: SJ1.1 37.7,13.43 arc45 39.49,14.17 39.86,14.53 arc45 40.6,16.33 P1.1 arc-45 40.48,18.73 v38.38,18.73
VCCIO  (via drill 0.2)
  Top 0.254: R5.1 3.6,6.21 arc45 v3.62,6.15
  Top 0.305: R2.1 13.1,25.1 arc45 R1.1 13.15,23.55 arc45 C3.1 | R4.1 4.58,25.57 arc45 5.42,25.93 arc-45 6.03,26.18 U1.8 arc-45 7.49,25.91 7.58,25.82 arc45 8.3,25.52 | 8.3,25.52 U1.2 8.64,25.52 arc45 7.55,25.07 arc-45 7.07,24.88 U1.6 | C11.1 8.92,23.15 arc-45 8.38,23.38 8.16,23.59 arc-45 7.83,24.4 arc-45 8.29,25.51 8.3,25.52
  Top 0.406: v22.62,2.75 23.95,2.75 arc45 IC3.2 24.31,2.76 arc-45 25.9,2.1 26.23,1.77 arc45 27.42,1.27 29.6,1.27 arc45 31.22,1.94 32.1,2.82 arc45 32.84,4.62 J1.4 32.84,8.64 arc-45 33.58,10.43 34.9,11.75 arc-45 36.69,12.49 X1.8 arc-45 46.08,11.42 R17.1 R3.1 R14.1 46.08,5.45 arc45 R16.1 | U2.5 arc45 16.6,22.39 v16.6,22
  Top 0.508: C11.1 C7.1 arc45 11.91,23.12 C3.1 C1.1 arc-45 14.86,23.15 U2.5
  Route15 0.305: v3.62,6.15 4.33,6.86 arc45 5.08,8.65 5.08,11.43 arc45 4.33,13.22 v4.28,13.28
  Bottom 0.305: 14.78,8.55 arc-45 14.21,7.18 13.92,6.89 arc-45 12.12,6.15 v3.62,6.15 | J7.3 v4.28,13.28
  Bottom 0.406: v16.6,22 15.52,20.92 arc45 14.78,19.12 14.78,8.55 14.78,7.88 arc45 15.52,6.08 18.11,3.49 arc45 19.9,2.75 v22.62,2.75

### Text on the board
Bottom: Philophrosyne v2.0 / by Tanmoy